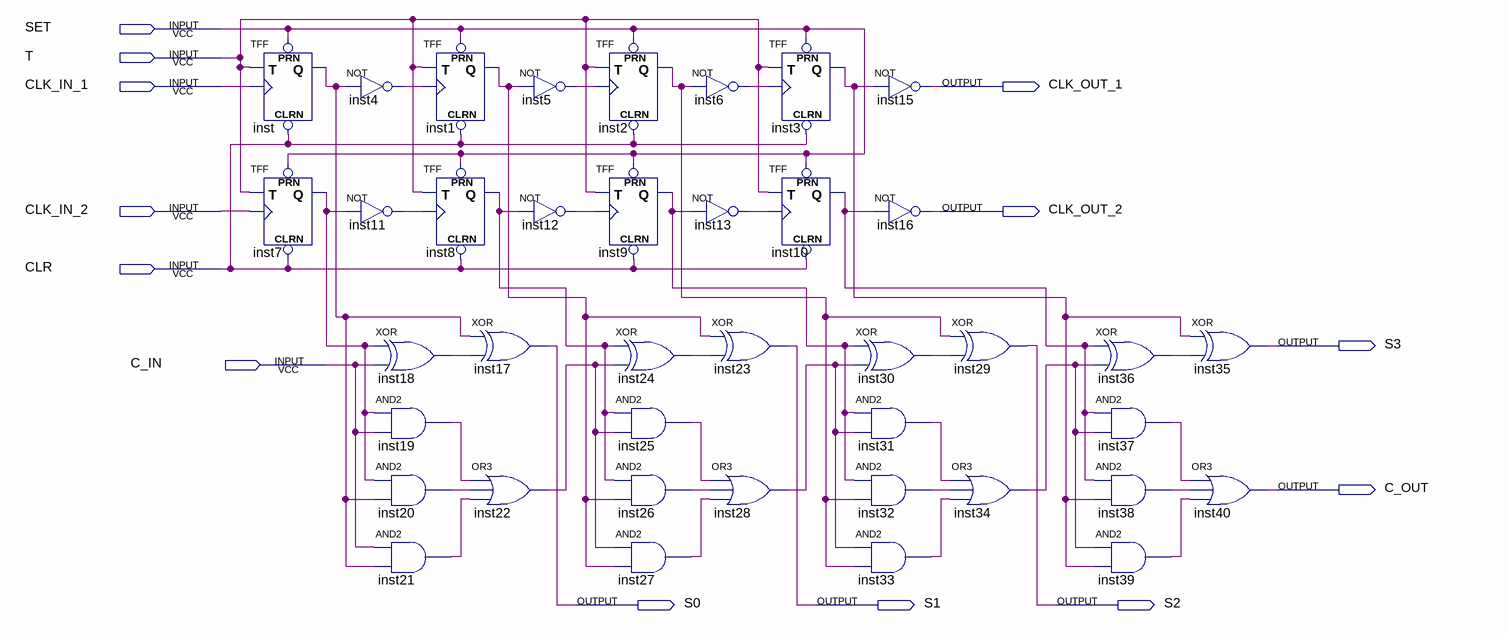
[diagram p0: schematic sheet]
// Quartus schematic clk_multiplier.bdf as structural Verilog: 40 symbols, 13 pins
module clk_multiplier (
  input  SET,
  input  T,
  input  CLK_IN_1,
  input  CLK_IN_2,
  input  CLR,
  input  C_IN,
  output CLK_OUT_1,
  output CLK_OUT_2,
  output S3,
  output C_OUT,
  output S0,
  output S1,
  output S2
);

  wire inst1_q, inst2_q, inst3_q, inst4_out, inst5_out, inst6_out, inst7_q, inst8_q, inst9_q, inst10_q,
       inst11_out, inst12_out, inst13_out, inst18_out, inst19_out, inst20_out, inst21_out, inst22_out,
       inst24_out, inst25_out, inst26_out, inst27_out, inst28_out, inst30_out, inst31_out, inst32_out,
       inst33_out, inst34_out, inst36_out, inst37_out, inst38_out, inst39_out, inst_q;

  TFF inst (.PRN(SET), .CLRN(CLR), .T(T), .CLK(CLK_IN_1), .Q(inst_q));
  TFF inst7 (.PRN(SET), .CLRN(CLR), .T(T), .CLK(CLK_IN_2), .Q(inst7_q));
  not inst4 (inst4_out, inst_q);
  not inst11 (inst11_out, inst7_q);
  xor inst18 (inst18_out, inst7_q, C_IN);
  and inst19 (inst19_out, inst7_q, C_IN);
  and inst20 (inst20_out, inst7_q, inst_q);
  and inst21 (inst21_out, C_IN, inst_q);
  TFF inst1 (.PRN(SET), .CLRN(CLR), .T(T), .CLK(inst4_out), .Q(inst1_q));
  TFF inst8 (.PRN(SET), .CLRN(CLR), .T(T), .CLK(inst11_out), .Q(inst8_q));
  not inst5 (inst5_out, inst1_q);
  not inst12 (inst12_out, inst8_q);
  xor inst17 (S0, inst_q, inst18_out);
  or inst22 (inst22_out, inst19_out, inst20_out, inst21_out);
  TFF inst2 (.PRN(SET), .CLRN(CLR), .T(T), .CLK(inst5_out), .Q(inst2_q));
  TFF inst9 (.PRN(SET), .CLRN(CLR), .T(T), .CLK(inst12_out), .Q(inst9_q));
  xor inst24 (inst24_out, inst8_q, inst22_out);
  and inst25 (inst25_out, inst8_q, inst22_out);
  and inst26 (inst26_out, inst8_q, inst1_q);
  and inst27 (inst27_out, inst22_out, inst1_q);
  not inst6 (inst6_out, inst2_q);
  not inst13 (inst13_out, inst9_q);
  TFF inst3 (.PRN(SET), .CLRN(CLR), .T(T), .CLK(inst6_out), .Q(inst3_q));
  TFF inst10 (.PRN(SET), .CLRN(CLR), .T(T), .CLK(inst13_out), .Q(inst10_q));
  xor inst23 (S1, inst1_q, inst24_out);
  or inst28 (inst28_out, inst25_out, inst26_out, inst27_out);
  not inst15 (CLK_OUT_1, inst3_q);
  not inst16 (CLK_OUT_2, inst10_q);
  xor inst30 (inst30_out, inst9_q, inst28_out);
  and inst31 (inst31_out, inst9_q, inst28_out);
  and inst32 (inst32_out, inst9_q, inst2_q);
  and inst33 (inst33_out, inst28_out, inst2_q);
  xor inst29 (S2, inst2_q, inst30_out);
  or inst34 (inst34_out, inst31_out, inst32_out, inst33_out);
  xor inst36 (inst36_out, inst10_q, inst34_out);
  and inst37 (inst37_out, inst10_q, inst34_out);
  and inst38 (inst38_out, inst10_q, inst3_q);
  and inst39 (inst39_out, inst34_out, inst3_q);
  xor inst35 (S3, inst3_q, inst36_out);
  or inst40 (C_OUT, inst37_out, inst38_out, inst39_out);
endmodule
